# Altium schematic sheet Actuators.SchDoc: Actuators
size A3; SheetNumber: 6
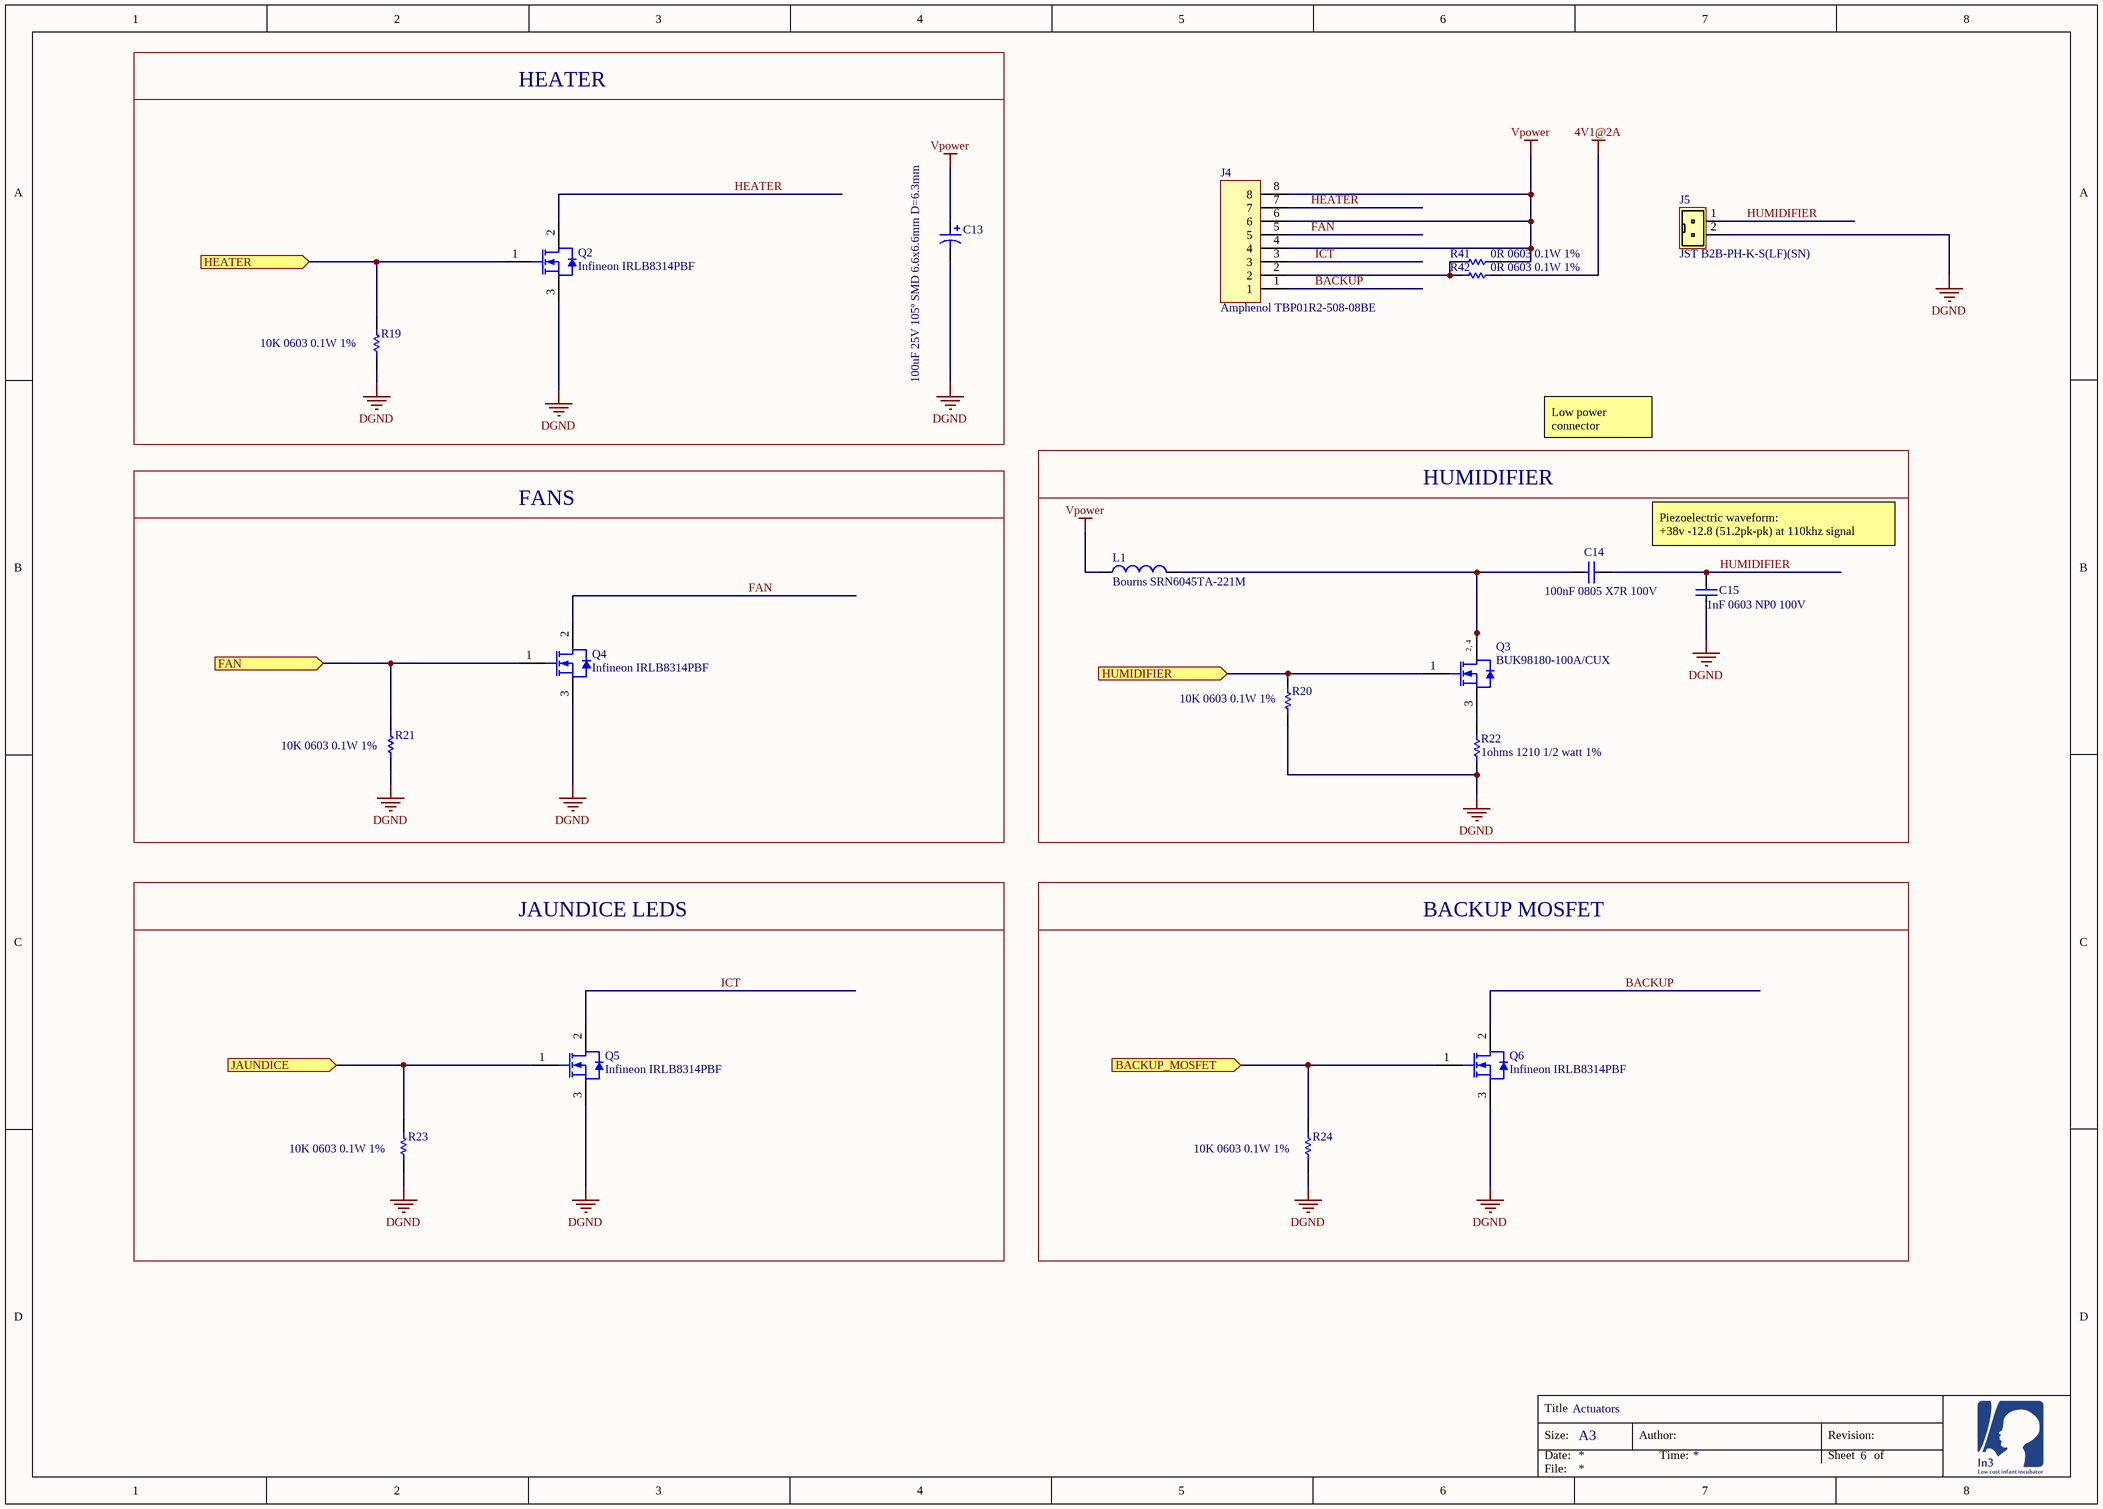
[diagram p0: Actuators.SchDoc]

## Parts
C13  100uF 25V 105º SMD 6.6x6.6mm D=6.3mm  [PCB-5eg0a5nygcrzw5ibm1j9-1]
C14  100nF 0805 X7R 100V  [CAPC2013X110X50ML20T25]  (no BOM)
C15  1nF 0603 NP0 100V  [CAPC1608X60X35NL10T15]  (no BOM)
J4  Amphenol TBP01R2-508-08BE  [PCB-9bbxoaz61thsmuxn7f5e-1]
J5  JST B2B-PH-K-S(LF)(SN)  [PCB-so191l03tuzsl9xcnbls-1]
L1  Bourns SRN6045TA-221M  [PCB-wv16t2tzy3vtnr72ahin-1]  (no BOM)
Q2  Infineon IRLB8314PBF  [PCB-s29nlaacffy4qzcyhtz9-1]
Q3  BUK98180-100A/CUX  [NXP-SOT223_L]  (no BOM)
Q4  Infineon IRLB8314PBF  [PCB-s29nlaacffy4qzcyhtz9-1]
Q5  Infineon IRLB8314PBF  [PCB-s29nlaacffy4qzcyhtz9-1]
Q6  Infineon IRLB8314PBF  [PCB-s29nlaacffy4qzcyhtz9-1]
R19  10K 0603 0.1W 1%  [RESC1609X55X30ML10T20]
R20  10K 0603 0.1W 1%  [RESC1609X55X30ML10T20]  (no BOM)
R21  10K 0603 0.1W 1%  [RESC1609X55X30ML10T20]
R22  1ohms 1210 1/2 watt 1%  [RESC3225X60X45NL20T20]  (no BOM)
R23  10K 0603 0.1W 1%  [RESC1609X55X30ML10T20]
R24  10K 0603 0.1W 1%  [RESC1609X55X30ML10T20]
R41  0R 0603 0.1W 1%  [RESC1609X55X30ML10T20]  (no BOM)
R42  0R 0603 0.1W 1%  [RESC1609X55X30ML10T20]

## Blocks framed on the sheet
HEATER: C13 Q2 R19
HUMIDIFIER: C14 C15 L1 Q3 R20 R22
FANS: Q4 R21
JAUNDICE LEDS: Q5 R23
BACKUP MOSFET: Q6 R24

## Ports
BACKUP_MOSFET (in), FAN (in), HEATER (in), HUMIDIFIER (in), JAUNDICE (in)

## Nets
4V1@2A: R42.2
DGND: C13.2 C15.2 J5.2 Q2.3(S) Q4.3(S) Q5.3(S) Q6.3(S) R19.1 R20.1 R21.1 R22.1 R23.1 R24.1
Vpower: C13.1 J4.4 J4.6 J4.8 L1.1 R41.2
BACKUP: J4.1 Q6.2(D)
BACKUP_MOSFET: Q6.1(G) R24.2 ; port BACKUP_MOSFET
FAN: Q4.1(G) R21.2 ; port FAN
FAN: J4.5 Q4.2(D)  [a separate net that carries the same name]
HEATER: Q2.1(G) R19.2 ; port HEATER
HEATER: J4.7 Q2.2(D)  [a separate net that carries the same name]
HUMIDIFIER: Q3.1(G) R20.2 ; port HUMIDIFIER
HUMIDIFIER: C14.2 C15.1 J5.1  [a separate net that carries the same name]
ICT: J4.3 Q5.2(D)
JAUNDICE: Q5.1(G) R23.2 ; port JAUNDICE
NetC14_1: C14.1 L1.2 Q3.2(D) Q3.4(D)
NetJ4_2: J4.2 R41.1 R42.1
NetQ3_3: Q3.3(S) R22.2

## Notes on the sheet
- Low power connector
- Piezoelectric waveform:
  +38v -12.8 (51.2pk-pk) at 110khz signal
- Title
- Size:
- Date:
- A3
- Author:
- Time:
- Revision:
- Sheet
- of
- File:
- (in symbol CMP-20463525-2) 2, 4

## Library data of the parts
C13 = CMP-a6d16ad512617916-1: Manufacturer Part Number: VZL101M1ETR-0607; Tolerance: 20%; Octopart URL: https://octopart.com/vzl101m1etr-0607-lelon-84840918; OctopartID: a6d16ad512617916; Capacity: 100uF; Voltage rating: 25V
C14 = CMP-3993849-2: CAP, CERAMIC, 0.1UF, 100V, X7R, 0805; Manufacturer Part Number: C0805C104K1RACAUTO; Capacitance: 1e-07 F; Capacitance Tolerance: ±10%; Lead-Free Status: R; Voltage Rating (DC): 100.0 V; Case/Package: 0805; Dielectric Characteristic: X7R; Dielectric Material: Ceramic; Mounting Style: Surface Mount; Octopart Url: https://octopart.com/c0805c104k1racauto-kemet-12625098; OctopartID: 1a32d3f89b9ec5f5; Packaging: Cut Tape (CT); REACH SVHC Compliance: No SVHC; RoHS: Compliant
C15 = CMP-119984-2: 1uF 0603 X5R 16V; Manufacturer Part Number: CC0603JRNPO0BN102; Capacitance Tolerance: ±10%; Case/Package (in): 0603; Lead-Free Status: Lead Free; Capacitance: 1uF; Dielectric Characteristic: X5R; Lifecycle Status: Active; Mounting Style: Surface Mount; Number of Pins: 2; Octopart Url: https://octopart.com/grm185r61c105ke44d-murata-197446; OctopartID: de3e1737f81e01f9; REACH SVHC Compliance: No SVHC; RoHS: Compliant; Size-Height: 0.0005 m; Size-Length: 0.0016 m; Size-Thickness: 0.0005 m; Size-Width: 0.0008 m; Rated voltage: 16V
J4 = CMP-fe5c33832e0f219b-3: Term Block Hdr 8POS 90DEG 5.08MM; Manufacturer Part Number: TBP01R2-508-08BE + TBP01P1-508-08BE; Mating connector: TBP01P1-508-08BE; OctopartID: fe5c33832e0f219b; Manufacturer Part Number 2: WJ2EDGVC-5.08-8P + KF2EDGK-5.08-8P
J5 = CMP-642947-25: Connector Header, PH Series, 2 Position, 2.00mm, Through Hole, Press-Fit, Solder, Natural; Voltage Rating (AC): 100 V; Lead-Free Status: Lead Free; Number of Contacts: 2; Housing Material: Nylon; Manufacturer Part Number: B2B-PH-K-S(LF)(SN); RoHS: Compliant; OctopartID: a21c6b154b5e7ddb; Housing Color: Natural; Packaging: Bulk; Operating Temperature: 85.0 °C (max)
L1 = CMP-d1e61c97cd460e21-1: Inductor Power Semi-Shielded Wirewound 220uH 20% 1MHz 15Q-Factor Ferrite 0.6A 0.9Ohm DCR 2424 Automotive T/R; Inductance: 220 µH; Octopart URL: https://octopart.com/srn6045ta-221m-bourns-75184582; Manufacturer Part Number: SRN6045TA-221M; Packaging: Cut Tape (CT); RoHS: Compliant; OctopartID: d1e61c97cd460e21; Manufacturer Part Number 2: SWPA6045S221MT
Q2 Q4-Q6 = CMP-b9737394b7fb66b4-2: Trans MOSFET N-CH 30V 171A 3-Pin(3+Tab) TO-220AB Tube
Q3 = CMP-20463525-2: N-Channel TrenchMOS Logic Level FET, 100 V, 4.6 A, 4-Pin SOT223, Tape and Reel; Manufacturer Part Number: BUK98180-100A/CUX; Lifecycle Status: Active; Octopart Url: https://octopart.com/buk98180-100a%2Fcux-nxp+semiconductors-30937972; OctopartID: 0bbbc3693da9d47c
R19-R21 R23 R24 = CMP-4716590-9: Octopart Url: https://octopart.com/crcw060310k0fkeahp-vishay-42634028; package: 0603; Resistance: 10k; Tolerance: 1%
R22 = CMP-1870171-2: Thick Film Resistors - SMD 3/4watt 1ohms 1%; Manufacturer Part Number: ERJ14YJ1R0U; Lead-Free Status: Lead Free; Power Rating: 0.5 W; Resistance: 1.0 Ω; Case/Package: 1210; Octopart Url: https://octopart.com/crcw12101r00fkeahp-vishay+dale-44516502; OctopartID: 16f4dd597704c933; Resistance Tolerance: ±1%; RoHS: Compliant
R41 R42 = CMP-536b9a7387ce8cac-10: HelpURL: http://www.yageo.com/documents/recent/PYu-RC_Group_51_RoHS_L_9.pdf; Resistance: 0R; package: 0603